# Altium project Power_Supply_MC.PrjPcb
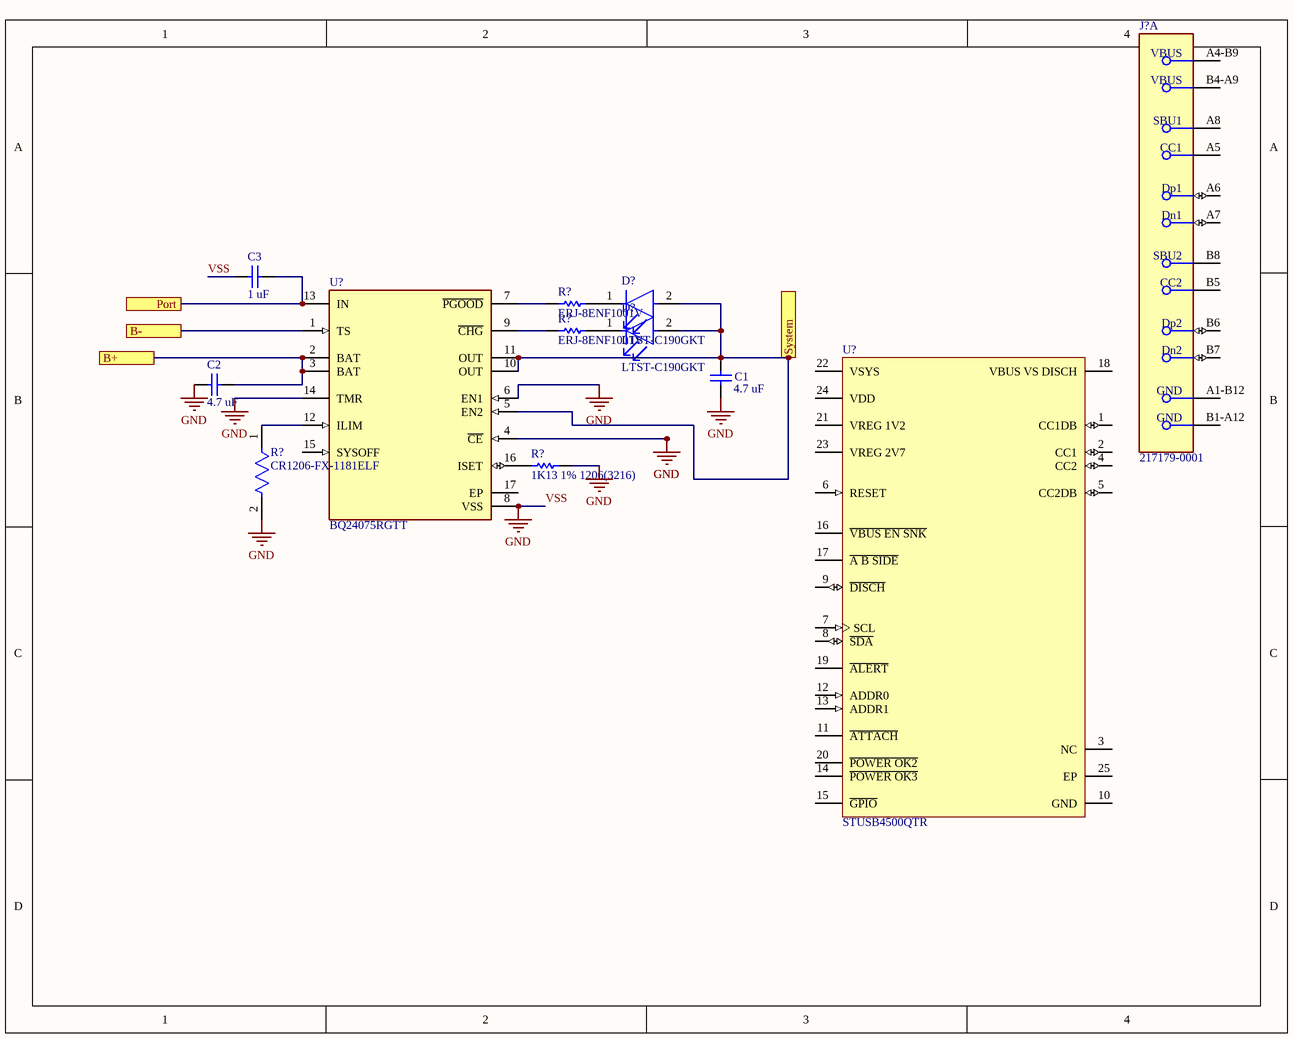
[diagram p0: Sheet1.SchDoc]
1 sheet, 12 parts. Net scope: flat (ports and power ports of the same name join across sheets).

## Sheet Sheet1.SchDoc
size A; SheetNumber: 1; SheetTotal: 1

### Parts
(Parts that share a designator on the sheet are numbered #1, #2 ... from top to bottom, then left to right.)
C1  4.7 uF  [CAPC2013X135X45LL10T25]
C2  4.7 uF  [CAPC2013X135X45LL10T25]
C3  1 uF  [CAPC2013X135X45LL10T25]
D?#1  LTST-C190GKT  [FP-LTST-C190GKT-MFG]
D?#2  LTST-C190GKT  [FP-LTST-C190GKT-MFG]
J?  217179-0001  [FP-2171790001-MFG]  (part A of 2)
R?#1  ERJ-8ENF1001V  [RESC3216X70X50LL05T20]
R?#2  ERJ-8ENF1001V  [RESC3216X70X50LL05T20]
R?#3  CR1206-FX-1181ELF  [FP-CR1206-IPC_A]
R?#4  1K13 1% 1206(3216)  [RESC1206(3216)_L]
U?#1  BQ24075RGTT  [FP-RGT0016C-IPC_C]
U?#2  STUSB4500QTR  [FP-QFN-24-EP_4x4-MFG]

### Ports
B+, B-, Port, System

### Nets
VSS: C1.1 C2.1 C3.1 R?#3.2 R?#4.2 U?#1.4(~{CE}) U?#1.6(EN1) U?#1.8(VSS) U?#1.14(TMR)  [also labelled GND]
NetC1_2: C1.2 D?#1.2(A) D?#2.2(A) U?#1.5(EN2) U?#1.10(OUT) U?#1.11(OUT) ; port System
NetC2_2: C2.2 U?#1.2(BAT) U?#1.3(BAT) ; port B+
NetC3_2: C3.2 U?#1.13(IN) ; port Port
NetD?#1_1: D?#1.1(C) R?#1.2
NetD?#2_1: D?#2.1(C) R?#2.2
NetR?#1_1: R?#1.1 U?#1.7(~{PGOOD})
NetR?#2_1: R?#2.1 U?#1.9(~{CHG})
NetR?#3_1: R?#3.1 U?#1.12(ILIM)
NetR?#4_1: R?#4.1 U?#1.16(ISET)
NetU?#1_1: U?#1.1(TS) ; port B-

Not connected (* = marked no-connect by the designer): J? A1-B12(GND) A4-B9(VBUS) A5(CC1) A6(Dp1) A7(Dn1) A8(SBU1) B1-A12(GND) B4-A9(VBUS) B5(CC2) B6(Dp2) B7(Dn2) B8(SBU2); U?#1 15(SYSOFF) 17(EP); U?#2 1(CC1DB) 2(CC1) 3(NC) 4(CC2) 5(CC2DB) 6(RESET) 7(SCL) 8(~{SDA}) 9(~{DISCH}) 10(GND) 11(~{ATTACH}) 12(ADDR0) 13(ADDR1) 14(~{POWER_OK3}) 15(~{GPIO}) 16(~{VBUS_EN_SNK}) 17(~{A_B_SIDE}) 18(VBUS_VS_DISCH) 19(~{ALERT}) 20(~{POWER_OK2}) 21(VREG_1V2) 22(VSYS) 23(VREG_2V7) 24(VDD) 25(EP)

### Library data of the parts
C1 C2 = CMP-1662-00015-2: Chip Capacitor, 4.7 uF, +/- 10%, 16 V, -55 to 85 degC, 0805 (2012 Metric), RoHS, Tape and Reel; PartNumber: GRM21BR61C475KA88L; Voltage Rating (DC): 16 V; Type (Capacitors): X5R; Case\/Package: 0805; Pins: 2; DatasheetVersion: 03/2016; REACH SVHC: No SVHC; Tolerance: 10%; Width: 1.25 mm; Capacitance: 4.7 uF; Mount: Surface Mount; ComponentLink1Description: Manufacturer URL; Case Code (Metric): 2012; PackageDescription: 2-Pin Surface Mount Device, Body 2 x 1.25 mm; Height: 1.25 mm; Voltage Rating: 16 V; Max Operating Temperature: 85 degC; RoHSCompliant: true; Length: 2 mm; ComponentLink1URL: http://www.murata.com/; Mounting Technology: Surface Mount; Packaging: Tape and Reel; Min Operating Temperature: -55 degC; ComponentLink2Description: Datasheet; Case Code (Imperial): 0805; Radiation Hardening: No; Package Quantity: 3000; PackageReference: 0805; ComponentLink2URL: http://search.murata.co.jp/Ceramy/image/img/A01X/G101/ENG/GRM21BR61C475KA88-01.pdf
C3 = CMP-1036-04761-2: Manufacturer: Murata; Part Number: GRM21BR71H105KA12L
D?#1 D?#2 = CMP-22017-000005-2: LED GREEN CLEAR CHIP SMD; Dominant Wavelength: 569nm; Reverse Voltage: 5V; Lens Color: Colorless; Viewing Angle: 130°; Voltage: 2V; Forward Current: 30mA; Power Dissipation: 100mW; Luminous Intensity: 6mcd; Number of LEDs: 1; Forward Voltage: 2.1V; Wavelength: 565nm; Test Current: 10mA; Min Operating Temperature: -55°C; Lens Style: Clear; Mount: Surface Mount; Width: 0.8mm; Packaging: Tape and Reel; Lens Transparency: Clear; Case Code (Metric): 1608; Depth: 0.8mm; Case Code (Imperial): 0603; Case/Package: 0603; Number of Pins: 2; Max Operating Temperature: 85°C; Lead Free: Lead Free; Number of Elements: 1; Length: 1.6mm; Height: 0.8mm; Package Quantity: 1; Power Rating: 100mW; Radiation Hardening: No; Illumination Color: Green; Color: Green
J? = CMP-04767-000028-2: CONN RCP USB2.0 TYP C 24P SMD RA; NexarPartId: 117190526; Gender: Receptacle; Number of Contacts: 16; Current Rating: 1.25A; Voltage Rating: 30V; Min Operating Temperature: -40°C; USB Standard: USB 2.0; Height: 3.36mm; Contact Material: Gold, Nickel; Max Operating Temperature: 85°C
R?#1 R?#2 = CMP-2003-00017-1: Manufacturer: Panasonic; Part Number: ERJ-8ENF1001V
R?#3 = CMP-07231-002969-1: Thick Film Chip Resistors 1206 1.18kΩ 0.25W 1% 100ppm/°C; Resistance: 1.18kR; Voltage Rating: 200V; Power Rating: 250mW; Length: 3.2mm; Military Standard: Not; Case/Package: 1206; Package Quantity: 5000; Depth: 1.6mm; Tolerance: 1%; Temperature Coefficient: 100ppm/°C; Composition: Thick Film; Packaging: Tape and Reel; Case Code (Imperial): 1206; Thickness: 610um; Max Operating Temperature: 155°C; Width: 1.6mm; Mount: Surface Mount; Height: 0.6mm; Contact Plating: Tin; Min Operating Temperature: -55°C; Termination: SMD/SMT; Case Code (Metric): 3216; Radiation Hardening: No
R?#4 = CMP-1014-00515-1: 1K13 0.25W 1% 1206 (3216 Metric)  SMD; Value: 1130.00 Ohm; Case-EIA: 1206; Case-Metric: 3216; Technology: SMT; Tolerance: 1 %; Power: 0.25 W
U?#1 = CMP-0321-00236-3: IC LI-ION CHARGE/PWR MGMT 16-QFN; Min Input Voltage: 4.3V; Output Voltage: 4.2V; Max Input Voltage: 26V; Min Supply Voltage: 4.35V; Max Supply Voltage: 6.4V; Min Output Voltage: 5.4V; Output Current: 1.5A; Number of Cells: 1; Max Output Current: 4.5A; Max Output Voltage: 5.6V; Battery Type: LITHIUM-ION; Package Quantity: 1; Length: 3.15mm; Weight: 0.000808oz; Termination: SMD/SMT; Height: 0.95mm; Series: -; Lead Free: Lead Free; Radiation Hardening: No; REACH SVHC: No SVHC; Case/Package: QFN; Number of Pins: 16; Width: 3.15mm; Max Operating Temperature: 85°C; Contact Plating: Gold; Max Charge Current: 1.5A; Packaging: Tape and Reel; Min Operating Temperature: -40°C
U?#2 = CMP-12113-000003-3: 4.1V~22V USB 2.0 I2C Controllers Interface ICs STUSB45 Controller 24-VFQFN Exposed Pad; Number of Ports: 1; Min Supply Voltage: 3V; Max Junction Temperature (Tj): 145°C; Max Supply Voltage: 22V; Interface: I2C, USB; USB Standard: USB 2.0; Lifecycle Status: Production; Schedule B: 8542390000, 8542390000; Min Operating Temperature: -40°C; Ambient Temperature Range High: 105°C; Max Operating Temperature: 105°C; Height: 1mm